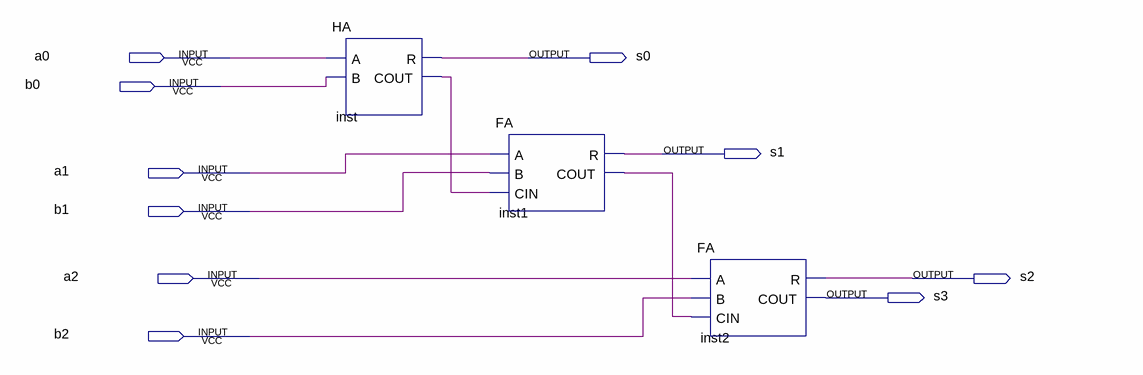
[diagram p0: schematic sheet]
// Quartus schematic sumas.bdf as structural Verilog: 3 symbols, 10 pins
module sumas (
  input  a0,
  input  b0,
  input  a1,
  input  b1,
  input  a2,
  input  b2,
  output s0,
  output s1,
  output s2,
  output s3
);

  wire inst1_cout, inst_cout;

  HA inst (.A(a0), .B(b0), .R(s0), .COUT(inst_cout));
  FA inst1 (.A(a1), .B(b1), .CIN(inst_cout), .R(s1), .COUT(inst1_cout));
  FA inst2 (.A(a2), .B(b2), .CIN(inst1_cout), .R(s2), .COUT(s3));
endmodule
